# EAGLE design ir-sensor-breakout-mk-3.0-smd (EAGLE 7.5.0)
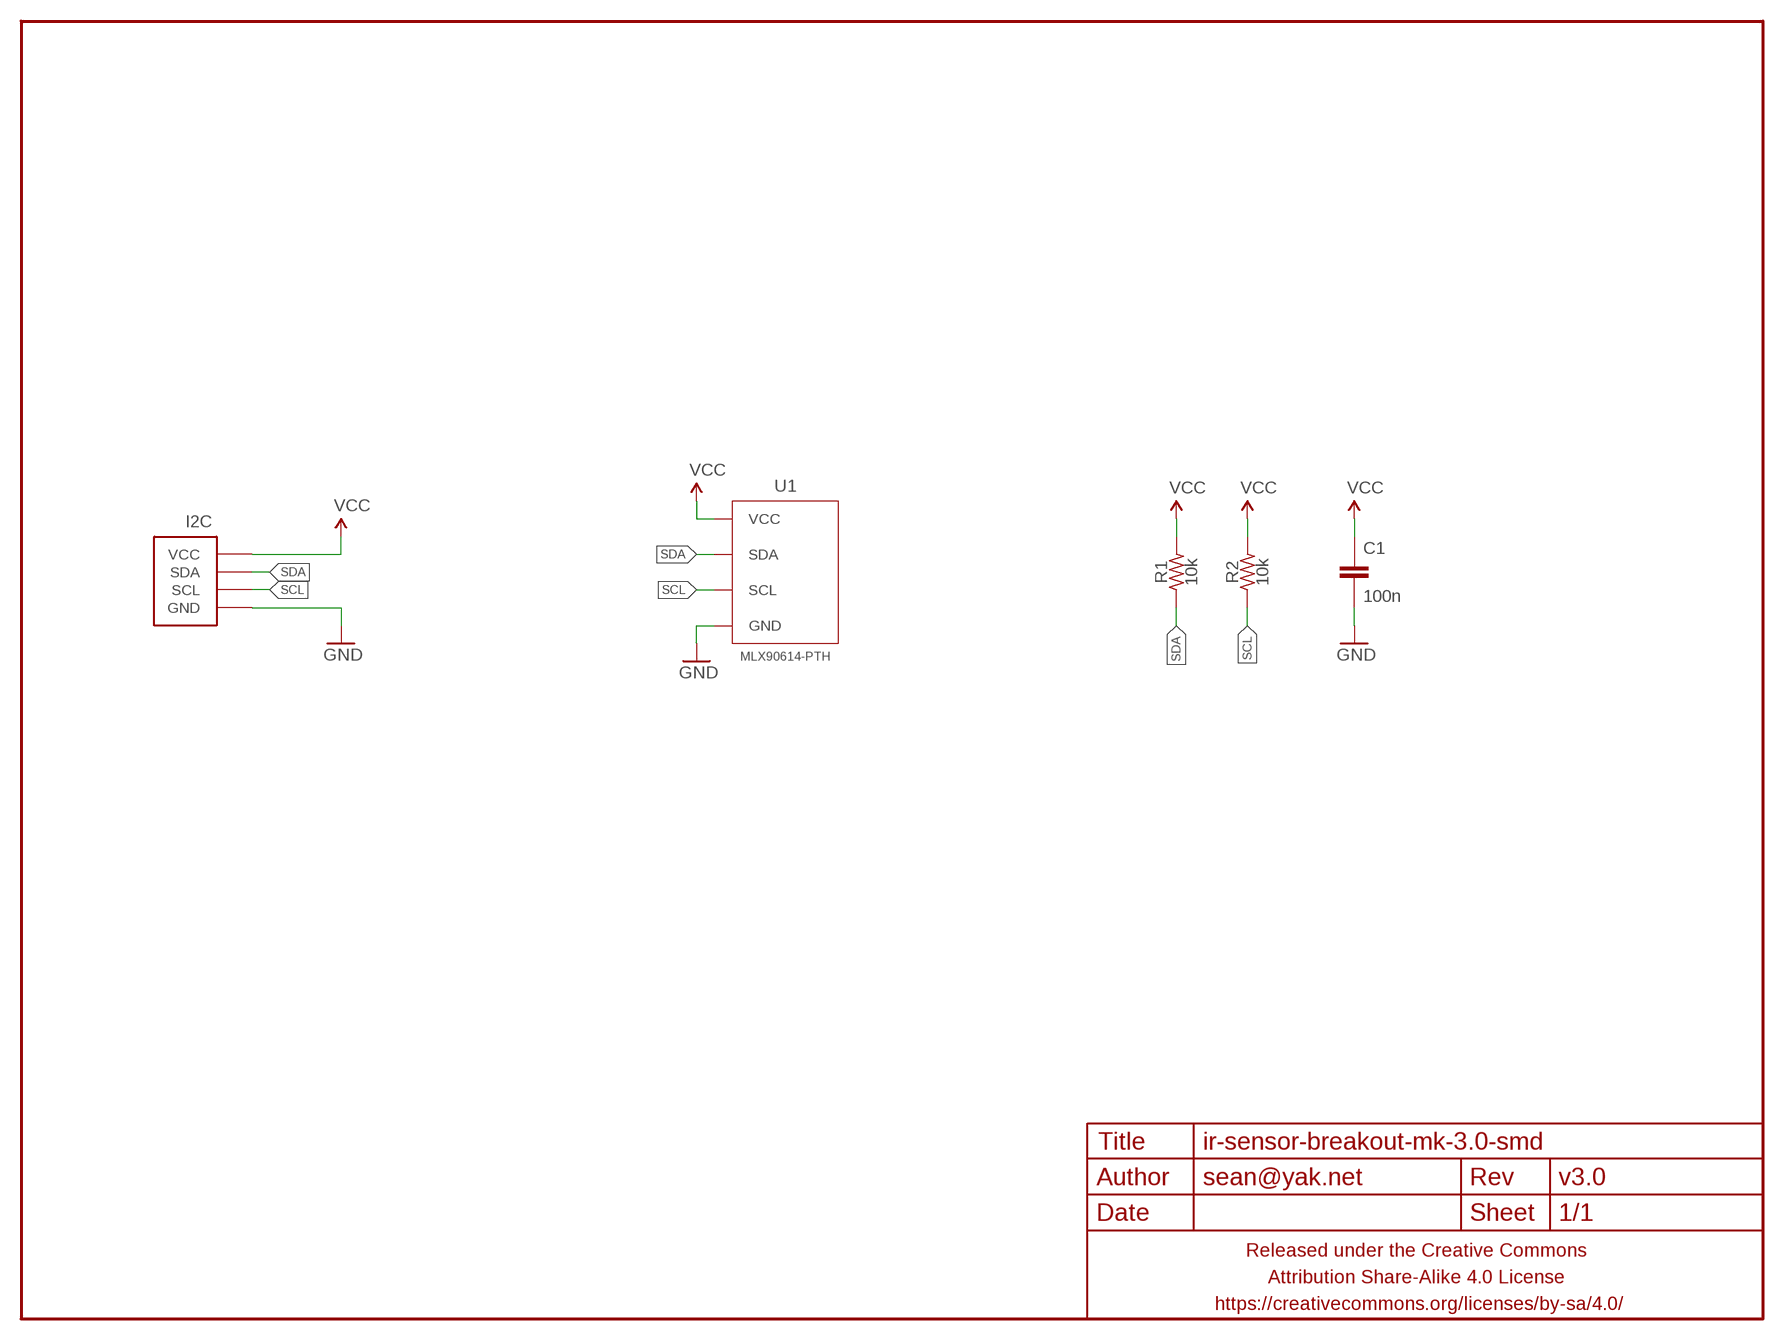
[diagram p0: schematic, sheet 1]

## Parts
C1  100n  CAPACITOR-CERAMICC0805  [C0805]
FRAME1  FRAME-LETTERNO_PACKAGE  [DUMMY]
I2C  M04-I2CPTH-0.1IN-CENTERED-FLIPPED  [1X04-PTH-VERT-I2C-CENTERED-FLIPPED]
R1  10k  RESISTORR0805  [R0805]
R2  10k  RESISTORR0805  [R0805]
U1  MLX90614-PTH  MLX906145V-PTH  [TO-39-4]

## Nets
GND: C1.2 I2C.GND U1.4(GND)
SCL: I2C.SCL R2.1 U1.1(SCL)
SDA: I2C.SDA R1.1 U1.2(SDA)
VCC: C1.1 I2C.VCC R1.2 R2.2 U1.3(VCC)

## Library data of the parts
C1 = a_parts:CAPACITOR-CERAMIC: CAPACITOR, European symbol
FRAME1 = A_butts:FRAME-LETTER: Schematic Frame Standard 8.5x11 US Letter frame; DESIGNER: sean@yak.net; VERSION: v3.0
I2C = a_parts:M04-I2C
R1 R2 = a_parts:RESISTOR: RESISTOR, American symbol
U1 = A_butts:MLX90614

## Board
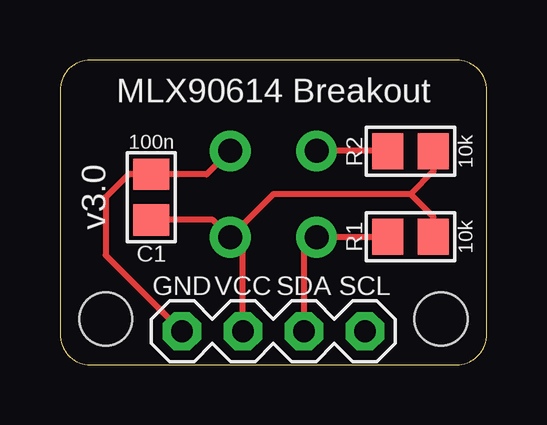
[diagram p1: board, top side]
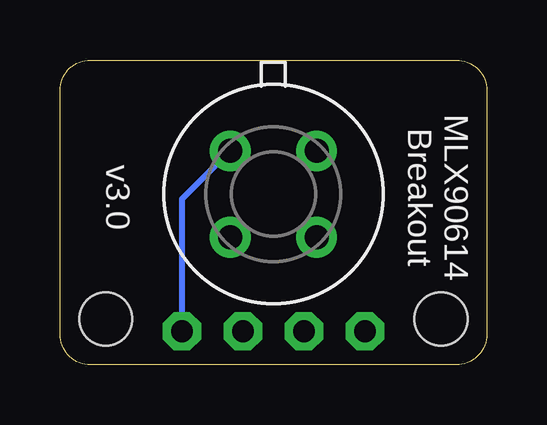
[diagram p2: board, bottom side, seen from below]

Size 17.78 x 12.7 mm. Coordinates in mm from the lower left corner, seen from the top.
Outline: 1.27,0 16.51,0 arc90 17.78,1.27 17.78,11.43 arc90 16.51,12.7 1.27,12.7 arc90 0,11.43 0,1.27 arc90 1.27,0
Copper layers (1*16): Top 0.0356mm / dielectric 1.5011mm / Bottom 0.0356mm
Design rules "LaenPCBOrder_2": minimum track width 6mil, minimum drill 13mil, track to track 6mil, track to pad 6mil, pad to pad 6mil, via to via 6mil, smd to smd 6mil, copper to edge 15mil, drill to drill 6mil, minimum pad ring 7mil, minimum via ring 7mil, stop-mask expansion 3mil, vias tented up to drill 20mil, thermal gap 10mil
Holes 2.2 mm at 1.91,1.91 15.88,1.91

### Footprints (pad centres in the part's own frame; a part is rotated, then mirrored left to right if it is on the bottom)
C0805 = smd 1.3 x 1.5: 1 -0.95,0; 2 0.95,0
1X04-PTH-VERT-I2C-CENTERED-FLIPPED = drill 0.9 pad 1.6 octagon: GND 3.81,0; SCL -3.81,0; SDA -1.27,0; VCC 1.27,0
R0805 = smd 1.3 x 1.5: 1 -0.95,0; 2 0.95,0
TO-39-4 = drill 1 pad 1.7: 1 -1.8,1.8; 2 -1.8,-1.8; 3 1.8,-1.8; 4 1.8,1.8

### Placement (x,y rotation side)
C1  3.81,6.99 90 top
FRAME1  0,0 0 top
I2C  8.89,1.4 180 top
R1  14.61,5.33 0 top
R2  14.61,8.89 0 top
U1  8.89,7.11 0 bottom

### Tracks (layer width: path | path; a pad name or v marks a point on that pad's centre or on a via)
GND
  Top 0.254: U1.4 6.11,7.93 C1.2 2.85,7.93 1.91,6.99 1.91,4.57 I2C.GND
SCL
  Top 0.254: R2.1 13.63,8.91 U1.1
  Bottom 0.254: U1.1 12.7,6.9 I2C.SCL
SDA
  Top 0.254: I2C.SDA 10.16,4.78 U1.2 10.71,5.33 R1.1
VCC
  Top 0.254: I2C.VCC 7.62,4.78 U1.3 | U1.3 6.37,6.04 C1.1 | R2.2 15.55,8.06 14.61,7.11 | 14.61,7.11 8.89,7.11 U1.3 | R1.2 15.55,6.16 14.61,7.11

### Text on the board
tPlace: MLX90614 Breakout
bPlace: MLX90614 / Breakout